# EAGLE design parkingsensor (EAGLE 5.11)
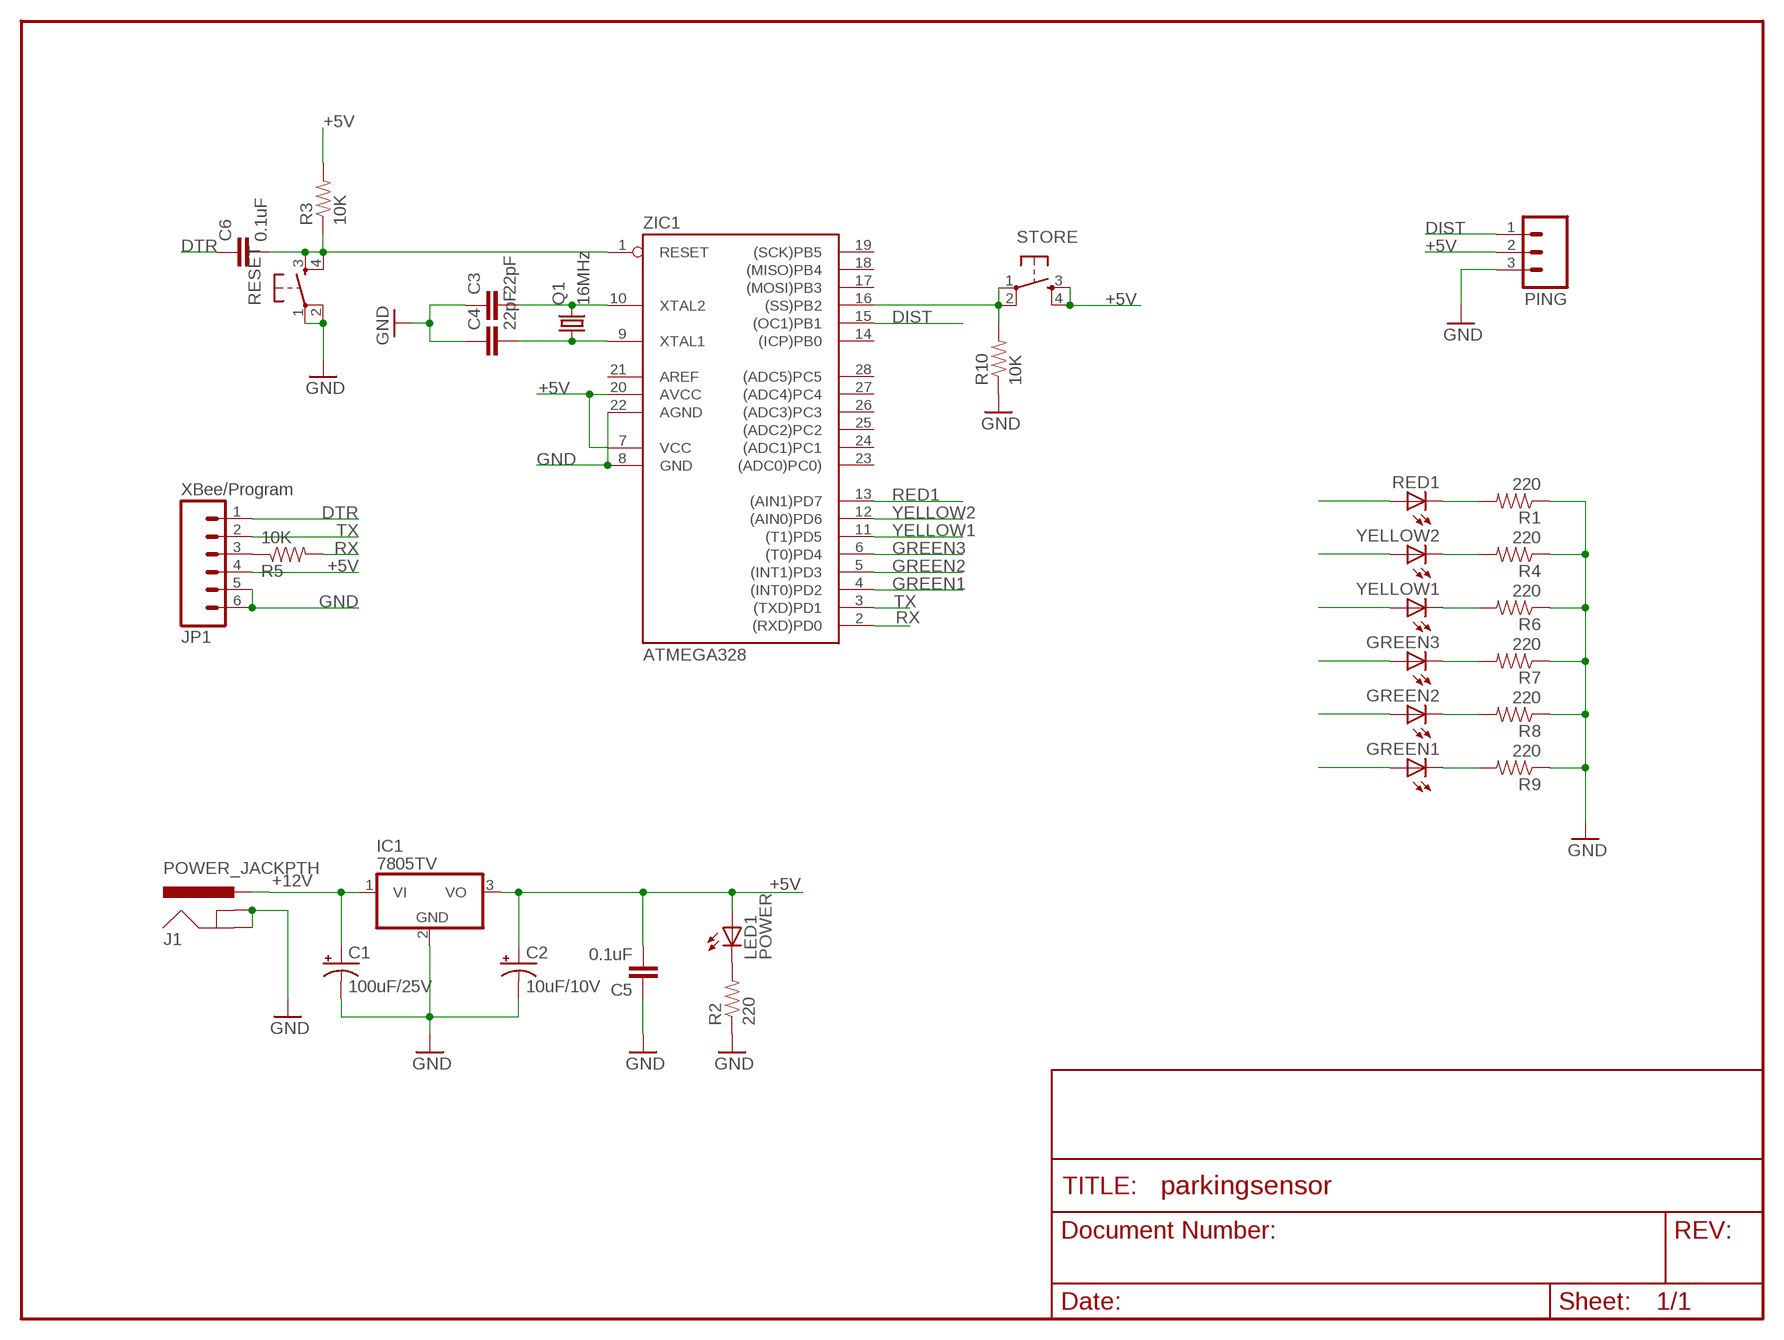
[diagram p0: schematic, sheet 1]

## Parts
C1  100uF/25V  CAP_POLPTH1  [CPOL-RADIAL-100UF-25V]
C2  10uF/10V  CAP_POLPTH1  [CPOL-RADIAL-100UF-25V]
C3  22pF  CAPPTH  [CAP-PTH-SMALL]
C4  22pF  CAPPTH  [CAP-PTH-SMALL]
C5  0.1uF  CAPPTH  [CAP-PTH-SMALL]
C6  0.1uF  CAPPTH  [CAP-PTH-SMALL]
GREEN1  LED10MM  [LED10MM]
GREEN2  LED10MM  [LED10MM]
GREEN3  LED10MM  [LED10MM]
IC1  7805TV  [TO220V]
J1  POWER_JACKPTH  [POWER_JACK_PTH]
JP1  XBee/Program  M06SIP  [1X06]
LED1  POWER  LED3MM  [LED3MM]
PING  M03PTH  [1X03]
Q1  16MHz  CRYSTALHC49S  [HC49/S]
R1  220  RESISTORAXIAL-0.3  [AXIAL-0.3]
R2  220  RESISTORAXIAL-0.3  [AXIAL-0.3]
R3  10K  RESISTORAXIAL-0.3  [AXIAL-0.3]
R4  220  RESISTORAXIAL-0.3  [AXIAL-0.3]
R5  10K  RESISTORAXIAL-0.3  [AXIAL-0.3]
R6  220  RESISTORAXIAL-0.3  [AXIAL-0.3]
R7  220  RESISTORAXIAL-0.3  [AXIAL-0.3]
R8  220  RESISTORAXIAL-0.3  [AXIAL-0.3]
R9  220  RESISTORAXIAL-0.3  [AXIAL-0.3]
R10  10K  RESISTORAXIAL-0.3  [AXIAL-0.3]
RED1  LED10MM  [LED10MM]
RESET  TAC_SWITCHPTH  [TACTILE-PTH]
STORE  TAC_SWITCHPTH  [TACTILE-PTH]
YELLOW1  LED10MM  [LED10MM]
YELLOW2  LED10MM  [LED10MM]
ZIC1  ATMEGA328  AT90S4433P  [DIL28-3]

## Nets
+5V: C2.1(+) C5.2 IC1.3(VO) JP1.4 LED1.A PING.2 R3.P$2 STORE.3 STORE.4 ZIC1.7(VCC) ZIC1.20(AVCC)
+12V: C1.1(+) IC1.1(VI) J1.PWR
DIST: PING.1 ZIC1.15((OC1)PB1)
DTR: C6.1 JP1.1
GND: C1.2(-) C2.2(-) C3.1 C4.1 C5.1 IC1.2(GND) J1.GND J1.GNDBREAK JP1.5 JP1.6 PING.3 R1.P$1 R2.P$1 R4.P$1 R6.P$1 R7.P$1 R8.P$1 R9.P$1 R10.P$1 RESET.1 RESET.2 ZIC1.8(GND) ZIC1.22(AGND)
GREEN1: GREEN1.A ZIC1.4((INT0)PD2)
GREEN2: GREEN2.A ZIC1.5((INT1)PD3)
GREEN3: GREEN3.A ZIC1.6((T0)PD4)
N$1: R1.P$2 RED1.K(C)
N$2: R4.P$2 YELLOW2.K(C)
N$3: R6.P$2 YELLOW1.K(C)
N$4: GREEN3.K(C) R7.P$2
N$5: C3.2 Q1.2 ZIC1.10(XTAL2)
N$6: LED1.K(C) R2.P$2
N$7: C4.2 Q1.1 ZIC1.9(XTAL1)
N$8: C6.2 R3.P$1 RESET.3 RESET.4 ZIC1.1(RESET)
N$9: JP1.3 R5.P$1
N$10: GREEN2.K(C) R8.P$2
N$11: GREEN1.K(C) R9.P$2
N$12: R10.P$2 STORE.1 STORE.2 ZIC1.16((SS)PB2)
RED1: RED1.A ZIC1.13((AIN1)PD7)
RX: R5.P$2 ZIC1.2((RXD)PD0)
TX: JP1.2 ZIC1.3((TXD)PD1)
YELLOW1: YELLOW1.A ZIC1.11((T1)PD5)
YELLOW2: YELLOW2.A ZIC1.12((AIN0)PD6)
Unconnected: ZIC1.14((ICP)PB0) ZIC1.17((MOSI)PB3) ZIC1.18((MISO)PB4) ZIC1.19((SCK)PB5) ZIC1.21(AREF) ZIC1.23((ADC0)PC0)) ZIC1.24((ADC1)PC1) ZIC1.25((ADC2)PC2) ZIC1.26((ADC3)PC3) ZIC1.27((ADC4)PC4) ZIC1.28((ADC5)PC5)

## Library data of the parts
C1 C2 = SparkFun:CAP_POL: Capacitor Polarized These are standard SMD and PTH capacitors. Normally 10uF, 47uF, and 100uF in electrolytic and tantalum varieties. Always verify the external diameter of the through hole cap, it varies with capacity, voltage, and manufacturer. The EIA devices should be standard.
C3-C6 = SparkFun:CAP: Capacitor Standard 0603 ceramic capacitor, and 0.1" leaded capacitor.
GREEN1-GREEN3 RED1 YELLOW1 YELLOW2 = led:LED: LED
IC1 = linear:78*: Positive VOLTAGE REGULATOR Source: http://cache.national.com/ds/LM/LM78L05.pdf http://www.fairchildsemi.com/ds/LM/LM7805.pdf
J1 = SparkFun:POWER_JACK: Power Jack This is the standard 5.5mm barrel jack for power. The PTH is the most common, proven, reliable, footprint. All others are experimental. The Slot footprint only works if the mill layer is transmitted to the PCB fab house so be warned. Spark Fun Electronics SKU : PRT-00119. Mating wall wart : TOL-00298 (and others)
JP1 = SparkFun:M06: Header 6 Standard 6-pin 0.1" header. Use with straight break away headers (SKU : PRT-00116), right angle break away headers (PRT-00553), swiss pins (PRT-00743), machine pins (PRT-00117), and female headers (PRT-00115). Molex polarized connector foot print use with SKU : PRT-08094 with associated crimp pins and housings. NOTES ON THE VARIANTS LOCK and LOCK_LONGPADS... This footprint was designed to help hold the alignment of a through-hole component (i.e. 6-pin header) while soldering it into place. You may notice that each hole has been shifted either up or down by 0.005 of an inch from it's more standard position (which is a perfectly straight line). This slight alteration caused the pins (the squares in the middle) to touch the edges of the holes. Because they are alternating, it causes a "brace" to hold the component in place. 0.005 has proven to be the perfect amount of "off-center" position when using our standard breakaway headers. Although looks a little odd when you look at the bare footprint, once you have a header in there, the alteration is very hard to notice. Also, if you push a header all the way into place, it is covered up entirely on the bottom side. This idea of altering the position of holes to aid alignment will be further integrated into the Sparkfun Library for other footprints. It can help hold any component with 3 or more connection pins.
LED1 = adafruit:LED: LED
PING = SparkFun:M03: Header 3 Standard 3-pin 0.1" header. Use with straight break away headers (SKU : PRT-00116), right angle break away headers (PRT-00553), swiss pins (PRT-00743), machine pins (PRT-00117), and female headers (PRT-00115). Molex polarized connector foot print use with SKU : PRT-08232 with associated crimp pins and housings.
Q1 = crystal:CRYSTAL: CRYSTAL; OC_FARNELL: 1667008; OC_NEWARK: unknown
R1-R10 = SparkFun:RESISTOR: Resistor Basic schematic elements and footprints for 0603, 1206, and PTH resistors.
RESET STORE = SparkFun:TAC_SWITCH: Momentary Switch Button commonly used for reset or general input. Spark Fun Electronics SKU : COM-00097
ZIC1 = atmel:AT90S4433: MICROCONTROLLER 4 Kbytes FLASH 128 bytes SRAM 256 bytes EEPROM UART 6-channel 10 bit ADC

## Net classes
0 default: width 0.254 mm, clearance 0.254 mm
2 gnd: width 0.305 mm, drill 0.559 mm, clearance 0.254 mm
3 usbvcc: width 0.508 mm, drill 0.61 mm, clearance 0.254 mm
4 aref: width 0.406 mm, drill 0.61 mm, clearance 0.254 mm

## Board
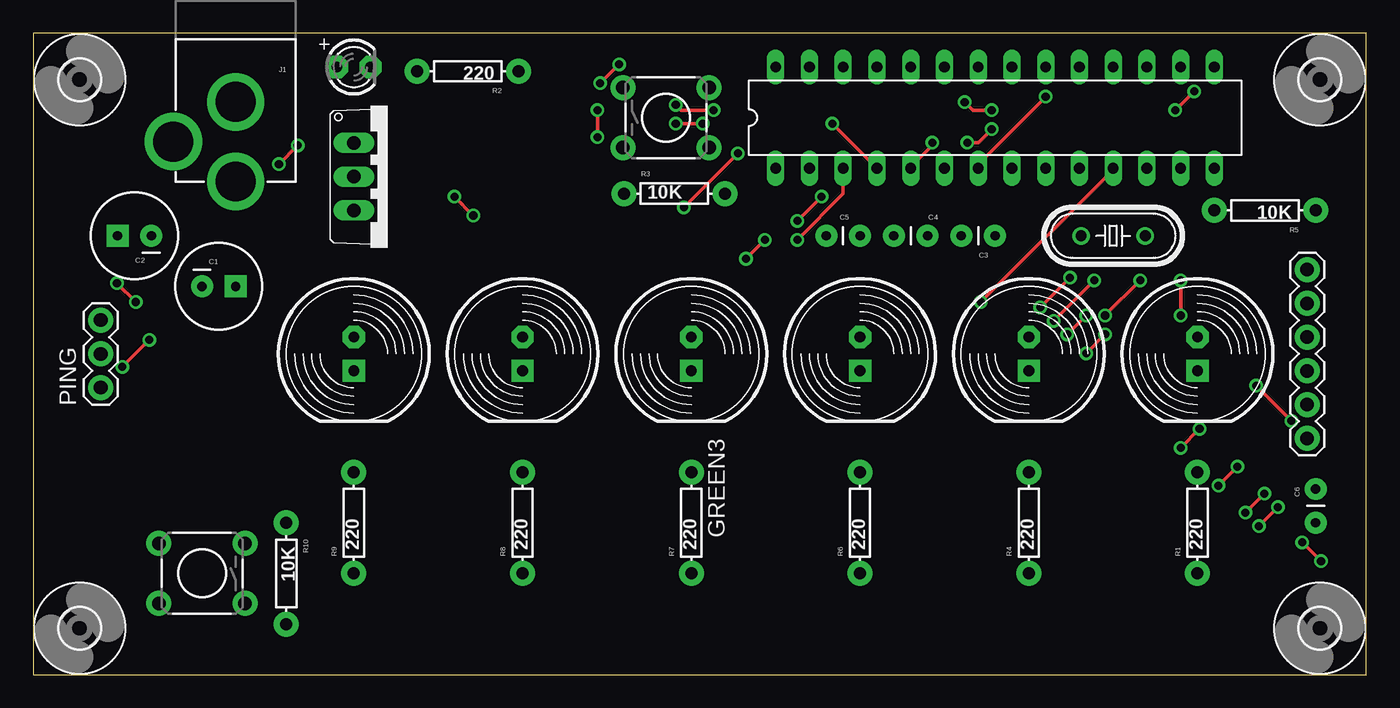
[diagram p1: board, top side]
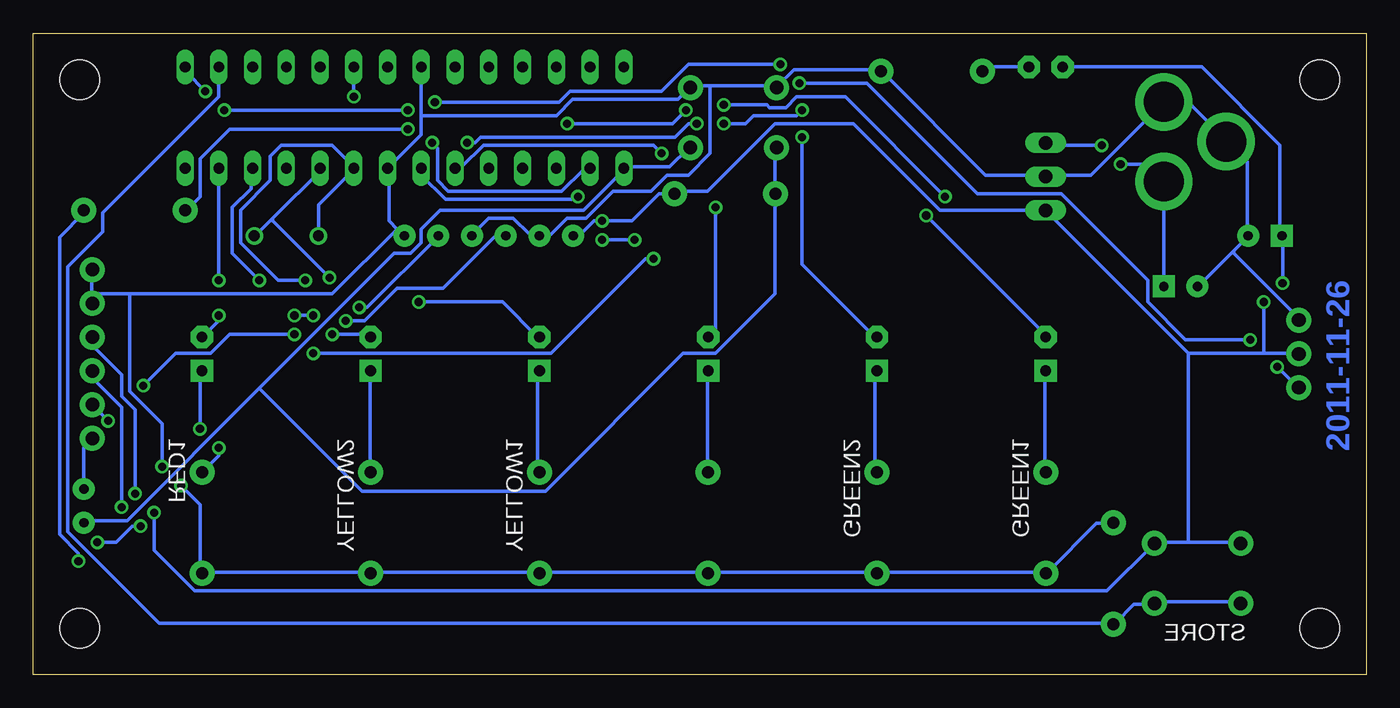
[diagram p2: board, bottom side, seen from below]

Size 100.33 x 48.26 mm. Coordinates in mm from the lower left corner, seen from the top.
Outline: 0,0 100.32,0 100.33,48.26 0,48.26 0,0
Copper layers (1*16): Top 0.035mm / dielectric 1.5mm / Bottom 0.035mm
Design rules "default": minimum track width 10mil, minimum drill 24mil, track to track 8mil, track to pad 8mil, pad to pad 8mil, via to via 8mil, smd to smd 8mil, copper to edge 40mil, drill to drill 8mil, minimum pad ring 10mil, minimum via ring 8mil, stop-mask expansion 4mil, vias tented up to drill 0mil, thermal gap 10mil

### Footprints (pad centres in the part's own frame; a part is rotated, then mirrored left to right if it is on the bottom)
CPOL-RADIAL-100UF-25V = drill 0.7 pad 1.651 square: 1 1.27,0 | drill 0.7 pad 1.651: 2 -1.27,0
CAP-PTH-SMALL = drill 0.7 pad 1.651: 1 0,0; 2 2.54,0
LED10MM = drill 0.813 pad 1.676 octagon: A -1.27,0 | drill 0.813 pad 1.676 square: K 1.27,0
TO220V = drill 1.016 long: 1 -2.54,-2.54; 2 0,-2.54; 3 2.54,-2.54
POWER_JACK_PTH = drill 2.997 pad 4.318: GND 0,7.7; GNDBREAK 4.7,10.7; PWR 0,13.7
1X06 = drill 1.016 pad 1.88: 1 0,0; 2 2.54,0; 3 5.08,0; 4 7.62,0; 5 10.16,0; 6 12.7,0
LED3MM = drill 0.813 pad 1.676 octagon: A -1.27,0; K 1.27,0
1X03 = drill 1.016 pad 1.88: 1 0,0; 2 2.54,0; 3 5.08,0
HC49/S = drill 0.813: 1 -2.413,0; 2 2.413,0
AXIAL-0.3 = drill 0.9 pad 1.88: P$1 -3.81,0; P$2 3.81,0
TACTILE-PTH = drill 1.016 pad 1.88: 1 -3.251,2.261; 2 3.251,2.261; 3 -3.251,-2.261; 4 3.251,-2.261
MOUNTINGHOLE_3.0 = hole 3: 0,0
DIL28-3 = drill 0.813 long: 1 -16.51,-3.81; 2 -13.97,-3.81; 3 -11.43,-3.81; 4 -8.89,-3.81; 5 -6.35,-3.81; 6 -3.81,-3.81; 7 -1.27,-3.81; 8 1.27,-3.81; 9 3.81,-3.81; 10 6.35,-3.81; 11 8.89,-3.81; 12 11.43,-3.81; 13 13.97,-3.81; 14 16.51,-3.81; 15 16.51,3.81; 16 13.97,3.81; 17 11.43,3.81; 18 8.89,3.81; 19 6.35,3.81; 20 3.81,3.81; 21 1.27,3.81; 22 -1.27,3.81; 23 -3.81,3.81; 24 -6.35,3.81; 25 -8.89,3.81; 26 -11.43,3.81; 27 -13.97,3.81; 28 -16.51,3.81

### Placement (x,y rotation side)
C1  13.97,29.21 0 top
C2  7.62,33.02 180 top
C3  72.39,33.02 180 top
C4  67.31,33.02 180 top
C5  62.23,33.02 180 top
C6  96.52,13.97 270 top
GREEN1  24.13,24.13 270 top
GREEN2  36.83,24.13 270 top
GREEN3  49.53,24.13 270 top
IC1  26.67,37.47 270 top
J1  15.24,50.8 180 top
JP1  95.89,17.78 90 top
LED1  24.13,45.72 0 top
PING  5.08,21.59 90 top
Q1  81.28,33.02 0 top
R1  87.63,11.43 90 top
R2  32.7,45.4 180 top
R3  48.26,36.2 0 top
R4  74.93,11.43 90 top
R5  92.71,34.92 180 top
R6  62.23,11.43 90 top
R7  49.53,11.43 90 top
R8  36.83,11.43 90 top
R9  24.13,11.43 90 top
R10  19.05,7.62 270 top
RED1  87.63,24.13 270 top
RESET  47.62,41.91 0 top
STORE  12.7,7.62 180 top
U$1  [MOUNTINGHOLE_3.0]  3.49,44.77 0 top
U$2  [MOUNTINGHOLE_3.0]  96.84,44.77 0 top
U$3  [MOUNTINGHOLE_3.0]  3.49,3.49 0 top
U$4  [MOUNTINGHOLE_3.0]  96.84,3.49 0 top
YELLOW1  62.23,24.13 270 top
YELLOW2  74.93,24.13 270 top
ZIC1  72.39,41.91 0 top

### Tracks (layer width: path | path; a pad name or v marks a point on that pad's centre or on a via)
+5V  (via drill 0.61)
  Top 0.254: v57.51,34.14 v59.33,35.97 | v76.2,43.48 71.12,38.41 71.12,38.2 ZIC1.7 | v7.72,28.04 v6.3,29.46 | v91.24,12.19 v92.66,13.61
  Bottom 0.254: v59.33,35.97 59.54,35.76 69.29,35.76 71.12,37.59 71.12,38 ZIC1.7 | C5.2 59.54,33.12 59.13,33.12 58.12,34.14 v57.51,34.14 55.27,34.14 53.24,36.17 52.22,36.17 R3.P$2 52.02,36.37 49.58,36.37 44.5,41.45 38.61,41.45 32.11,34.95 24.18,34.95 IC1.3 23.98,34.75 13.41,24.18 | v76.2,43.48 ZIC1.20 | LED1.A 22.76,45.72 12.39,45.72 6.5,39.83 6.5,33.12 C2.1 6.3,32.92 v6.3,29.46 | 7.72,24.18 5.08,24.18 PING.2 | 13.41,24.18 7.72,24.18 | 7.72,24.18 v7.72,28.04 | 13.41,9.96 15.85,9.96 STORE.3 16.05,9.75 19.51,6.3 88.19,6.3 91.24,9.35 v91.24,12.19 | 13.41,9.96 9.55,9.96 STORE.4 | v92.66,13.61 92.66,19.91 93.67,20.93 93.67,22.55 95.71,24.59 95.71,25.4 JP1.4 | 13.41,9.96 13.41,24.18
+12V  (via drill 0.61)
  Top 0.254: v18.49,38.41 v19.91,39.83
  Bottom 0.254: v19.91,39.83 23.98,39.83 IC1.1 | v18.49,38.41 16.46,38.41 15.24,37.19 J1.PWR 15.24,36.98 15.24,29.26 C1.1
DIST  (via drill 0.61)
  Top 0.254: v85.95,42.47 v87.38,43.89 | v72.14,42.47 70.71,42.47 v70.1,43.08 | v42.67,44.5 v44.09,45.92 | v6.71,23.16 v8.74,25.2
  Bottom 0.254: v87.38,43.89 88.8,45.31 88.8,45.72 ZIC1.15 | v72.14,42.47 v85.95,42.47 | v70.1,43.08 60.76,43.08 59.94,43.89 53.03,43.89 51,45.92 v44.09,45.92 | v42.67,44.5 37.59,44.5 29.26,36.17 22.96,36.17 16.46,29.67 16.46,28.04 13.61,25.2 v8.74,25.2 | v6.71,23.16 5.08,21.54 PING.1
DTR
  Bottom 0.254: C6.1 96.52,14.02 96.52,17.07 95.91,17.68 JP1.1
GND  (via drill 0.61)
  Top 0.254: v89.2,14.22 v90.63,15.65
  Bottom 0.254: R10.P$1 19.1,11.38 20.32,11.38 23.98,7.72 R9.P$1 24.18,7.72 36.78,7.72 R8.P$1 36.98,7.72 49.38,7.72 R7.P$1 49.58,7.72 62.18,7.72 R6.P$1 62.38,7.72 74.78,7.72 R4.P$1 74.98,7.72 87.58,7.72 R1.P$1 87.78,7.72 87.78,12.8 v89.2,14.22 | 95.91,28.65 95.91,30.48 JP1.6 | 95.91,28.65 95.91,28.04 JP1.5 95.91,28.65 | 72.95,33.53 72.54,33.12 C3.1 72.95,33.53 | 72.95,33.53 73.56,34.14 73.56,38 ZIC1.8 73.56,38.2 71.12,40.64 71.12,42.06 | 71.12,42.06 ZIC1.22 | 93.07,28.65 77.83,28.65 72.95,33.53 | 93.07,28.65 95.91,28.65 | 15.24,43.08 20.73,37.59 23.98,37.59 IC1.2 24.18,37.59 28.65,37.59 36.37,45.31 R2.P$1 36.58,45.52 43.08,45.52 44.3,44.3 RESET.1 44.5,44.3 49.38,44.3 | 15.24,43.08 J1.GND 15.24,43.08 | 9.96,31.9 12.6,29.26 C1.2 | 9.96,31.9 8.94,32.92 C2.2 8.94,33.12 8.94,38.61 10.36,40.03 J1.GNDBREAK 10.57,40.23 13.41,43.08 15.24,43.08 | 9.96,31.9 9.96,31.7 5.08,26.82 PING.3 | C4.1 67.26,33.12 66.04,34.34 64.21,34.34 62.99,33.12 62.38,33.12 C5.1 62.18,33.12 61.37,33.12 60.15,34.34 58.73,34.34 56.69,36.37 53.85,36.37 52.63,37.59 51,37.59 49.38,39.22 49.38,44.3 | 49.38,44.3 50.8,44.3 RESET.2 51,44.09 51.82,43.28 59.74,43.28 60.96,42.06 71.12,42.06 | v90.63,15.65 90.63,18.9 93.07,21.34 93.07,28.65
GREEN1  (via drill 0.61)
  Top 0.254: v60.15,41.45 63.4,38.2 ZIC1.4 | v51.21,42.47 48.77,42.47 v48.36,42.88 | v33.12,34.54 v31.7,35.97
  Bottom 0.254: v60.15,41.45 52.22,41.45 v51.21,42.47 | v48.36,42.88 45.11,42.88 44.91,42.67 43.69,42.67 42.88,43.48 39.22,43.48 v31.7,35.97 | v33.12,34.54 23.98,25.4 GREEN1.A
GREEN2  (via drill 0.61)
  Top 0.254: v67.67,40.03 67.67,39.83 66.04,38.2 ZIC1.5 | v48.36,41.45 v50.39,41.45 | v42.47,40.44 v42.47,42.47
  Bottom 0.254: v67.67,40.03 67.06,40.03 66.65,40.44 52.02,40.44 51,41.45 v50.39,41.45 | v48.36,41.45 46.74,41.45 46.13,42.06 42.88,42.06 v42.47,42.47 | v42.47,40.44 42.47,30.89 36.98,25.4 GREEN2.A
GREEN3  (via drill 0.61)
  Top 0.254: v48.97,35.15 v53.03,39.22
  Bottom 0.254: v53.03,39.22 53.65,39.83 66.45,39.83 68.07,38.2 68.48,38.2 ZIC1.6 | v48.97,35.15 48.97,25.81 49.38,25.4 GREEN3.A
N$1  (via drill 0.61)
  Top 0.254: v86.36,17.07 v87.78,18.49
  Bottom 0.254: v87.78,18.49 87.78,22.76 RED1.K | v86.36,17.07 86.36,16.46 87.58,15.24 R1.P$2
N$2
  Bottom 0.254: YELLOW2.K 74.98,22.76 74.98,15.24 R4.P$2
N$3
  Bottom 0.254: YELLOW1.K 62.38,22.76 62.38,15.24 R6.P$2
N$4
  Bottom 0.254: GREEN3.K 49.58,22.76 49.58,15.24 R7.P$2
N$5  (via drill 0.61)
  Top 0.254: v75.79,27.64 v78.03,29.87
  Bottom 0.254: 82.3,34.34 78.64,38 ZIC1.10 | 82.3,34.34 83.52,33.12 Q1.2 | v75.79,27.64 75.18,27.64 69.9,32.92 C3.2 | v78.03,29.87 82.3,34.14 82.3,34.34
N$6
  Bottom 0.254: LED1.K 28.65,45.72 28.85,45.52 R2.P$2
N$7  (via drill 0.61)
  Top 0.254: v76.81,26.62 v79.86,29.67
  Bottom 0.254: Q1.1 78.84,33.12 78.84,35.36 76.2,38 ZIC1.9 76.2,38.2 77.83,39.83 81.69,39.83 82.5,39.01 82.5,37.19 84.73,34.95 84.73,32.51 81.89,29.67 v79.86,29.67 | v76.81,26.62 75.39,26.62 72.95,29.06 69.49,29.06 65.63,32.92 64.82,32.92 C4.2
N$8
  Bottom 0.254: RESET.3 44.5,39.62 44.5,36.37 R3.P$1 44.5,36.17 44.5,28.65 48.97,24.18 51.41,24.18 61.77,13.82 75.59,13.82 83.31,21.54 | RESET.4 51,39.62 52.43,38.2 55.88,38.2 ZIC1.1 55.88,38 58.93,34.95 69.7,34.95 71.12,33.53 71.12,32.51 71.93,31.7 73.15,31.7 83.31,21.54 | 83.31,21.54 93.27,11.58 96.52,11.58 C6.2
N$9  (via drill 0.61)
  Top 0.254: v92.25,11.18 v93.67,12.6 | v95.5,9.96 v96.93,8.53
  Bottom 0.254: v93.67,12.6 93.67,20.12 95.71,22.15 95.71,22.76 JP1.3 | v92.25,11.18 92.86,11.18 94.08,9.96 v95.5,9.96 | v96.93,8.53 96.93,9.14 98.35,10.57 98.35,32.92 96.52,34.75 R5.P$1
N$10
  Bottom 0.254: GREEN2.K 36.98,22.76 36.98,15.24 R8.P$2
N$11
  Bottom 0.254: GREEN1.K 24.18,22.76 24.18,15.24 R9.P$2
N$12
  Bottom 0.254: STORE.2 9.55,5.49 15.85,5.49 STORE.1 16.05,5.28 17.48,5.28 18.9,3.86 R10.P$2 19.1,3.86 90.83,3.86 97.74,10.77 97.74,30.68 95.1,33.33 95.1,34.75 86.36,43.48 ZIC1.16
RED1  (via drill 0.61)
  Top 0.254: v86.36,27.03 v86.36,29.67
  Bottom 0.254: v86.36,29.67 86.36,38 ZIC1.13 | v86.36,27.03 86.36,26.62 87.58,25.4 RED1.A
RX  (via drill 0.61)
  Top 0.254: v70.31,40.03 71.12,40.03 v72.14,41.05
  Bottom 0.254: v70.31,40.03 69.9,39.62 69.9,37.19 69.09,36.37 60.55,36.37 58.93,38 58.52,38 ZIC1.2 | v72.14,41.05 85.55,41.05 87.78,38.81 87.78,35.97 88.8,34.95 R5.P$2
TX  (via drill 0.61)
  Top 0.254: v57.51,32.72 60.96,36.17 60.96,38 ZIC1.3 | v53.65,31.29 v55.07,32.72 | v79.25,24.18 v80.67,25.6 | v92.05,21.74 v94.69,19.1
  Bottom 0.254: v55.07,32.72 v57.51,32.72 | v53.65,31.29 54.25,31.29 61.37,24.18 v79.25,24.18 | v80.67,25.6 85.55,25.6 86.97,24.18 89.61,24.18 v92.05,21.74 | v94.69,19.1 95.91,20.32 JP1.2
YELLOW1  (via drill 0.61)
  Top 0.254: v71.32,28.04 81.28,38 ZIC1.11
  Bottom 0.254: v71.32,28.04 65.02,28.04 62.38,25.4 YELLOW1.A
YELLOW2  (via drill 0.61)
  Top 0.254: v80.67,27.03 v83.31,29.67 | v77.83,25.6 v79.25,27.03
  Bottom 0.254: v83.31,29.67 85.34,31.7 85.34,35.15 83.92,36.58 83.92,38 ZIC1.12 | v79.25,27.03 v80.67,27.03 | v77.83,25.6 75.18,25.6 74.98,25.4 YELLOW2.A

### Text on the board
Bottom: 2011-11-26
tValues: GND | CTS | 5V | RX | TX | DTR | Parking Sensor 1.0 - http://g.sud.to/ha